# EAGLE schematic ENGI301_PCB_design_project (EAGLE 8.7.0)
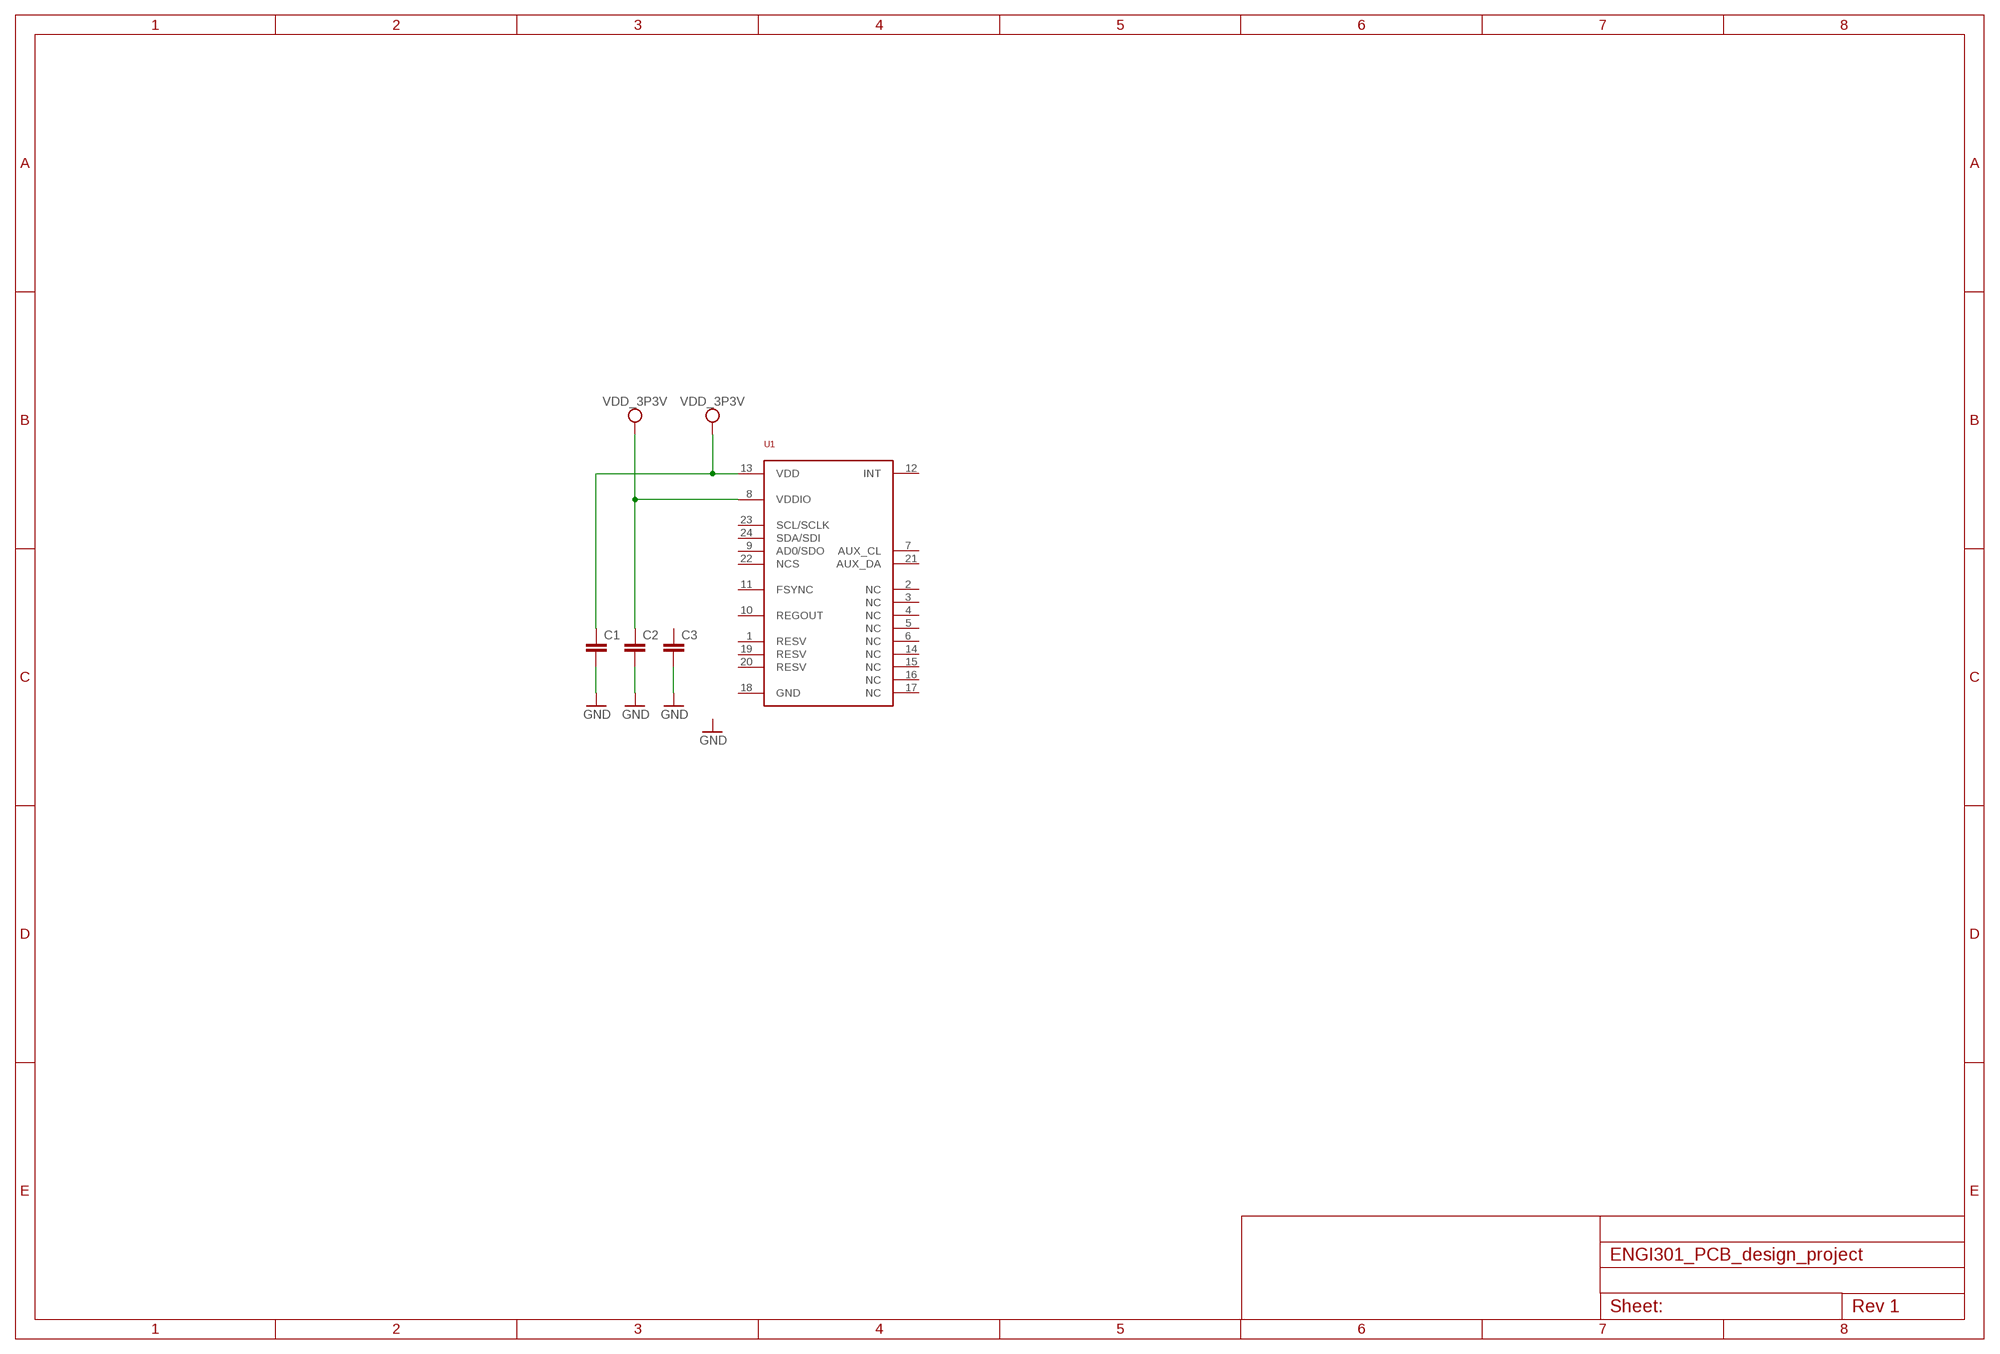
[diagram p0: schematic, sheet 1]

## Parts
C1  C_C0402  [C0402]
C2  C_C0402  [C0402]
C3  C_C0402  [C0402]
U1  MPU-9250  [QFN-3MMX3MM]

## Nets
GND: C1.2 C2.2 C3.2
SYS_VDD1_3P3V: C1.1 C2.1 U1.8(VDDIO) U1.13(VDD) ; supply symbol labelled VDD_3P3V
Unconnected: C3.1 U1.1(RESV) U1.2(NC) U1.3(NC) U1.4(NC) U1.5(NC) U1.6(NC) U1.7(AUX_CL) U1.9(AD0/SDO) U1.10(REGOUT) U1.11(FSYNC) U1.12(INT) U1.14(NC) U1.15(NC) U1.16(NC) U1.17(NC) U1.18(GND) U1.19(RESV) U1.20(RESV) U1.21(AUX_DA) U1.22(NCS) U1.23(SCL/SCLK) U1.24(SDA/SDI)

## Library data of the parts
C1-C3 = ENGI301_PCB_design_project:C_: Capacitor SMD. Sizes: 0402, 0603 & 0805
U1 = ENGI301_PCB_design_project:MPU-9250: MPU-9250 9-Axis IMU